# Altium project Button3x4S-1.PrjPCB
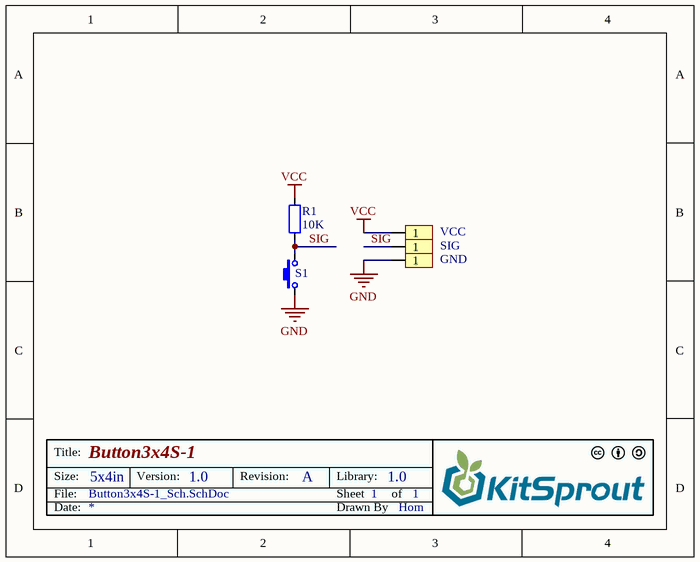
[diagram p0: Button3x4S-1_Sch.SchDoc]
1 sheet, 5 parts. Net scope: global (net labels, ports and power ports of the same name join across sheets).
Board file: Button3x4S-1_Pcb.PcbDoc

## Sheet Button3x4S-1_Sch.SchDoc: Button3x4S-1
size 127 x 101 mm; Author: Hom; CompanyName: KitSprout; DrawnBy: Hom; Engineer: Hom; Organization: KitSprout; Revision: A; SheetNumber: 1; SheetTotal: 1; License: CC BY-SA 4.0; Version: 1.0; LibVersion: 1.0; PageSetup: Record=PageOptions|CenterHorizontal=True|CenterVertical=True|PrintScale=1.00|XCorrection=1.00|YCorrection=1.00|PrintKind=0|BorderSize=5000000|LeftOffset=0|BottomOffset=0|Orientation=2|PaperLength=1000|PaperWidth=1000|Scale=100|PaperSource=7|PrintQuality=-4|MediaType=1|DitherType=10|PaperKind=A4|PrintScaleMode=0

### Parts
GND  HDR-PAD_2.54  [HDR-PAD_2.54]  (value not drawn)
R1  value 10K  [RES_0603]  (hidden comment: Res_0603)
S1  ButtonTACT_3x4x2_180  [ButtonTACT_3x4x2_180H]  (value not drawn)
SIG  HDR-PAD_2.54  [HDR-PAD_2.54]  (value not drawn)
VCC  HDR-PAD_2.54  [HDR-PAD_2.54]  (value not drawn)

### Nets
GND: GND.1 S1.1
VCC: R1.2 VCC.1
SIG: R1.1 S1.2 SIG.1

### Notes on the sheet
- Title:
- Size:
- Date:
- File:
- 5x4in
- Version:
- Revision:
- Sheet
- Drawn By
- Library:
- of

### Library data of the parts
GND SIG VCC = HDR-PAD_2.54: Header
R1 = Res_0603: Resistor
S1 = ButtonTACT_3x4x2_180: Button